# Altium schematic sheet QPL9065.SchDoc: Title
size 420 x 297 mm; CheckedBy: -; CompanyName: CERN; DrawnBy: DrawnBy; Organization: CERN; Address1: European Organization for Nuclear Research; Address2: CH-1211 Genčve 23 - Switzerland; DocumentNumber: 4; Revision: -; SheetNumber: 4; SheetTotal: 10; EDA_Number: EDA-XXXXX-VX-X; Projet: -; ModifiedBy: -; CreateDate: XX/XX/XXXX; CheckedDate: -; Title2: Title2; DivGrp: TE/MPE; Designer: Designer; ModifiedDate: -
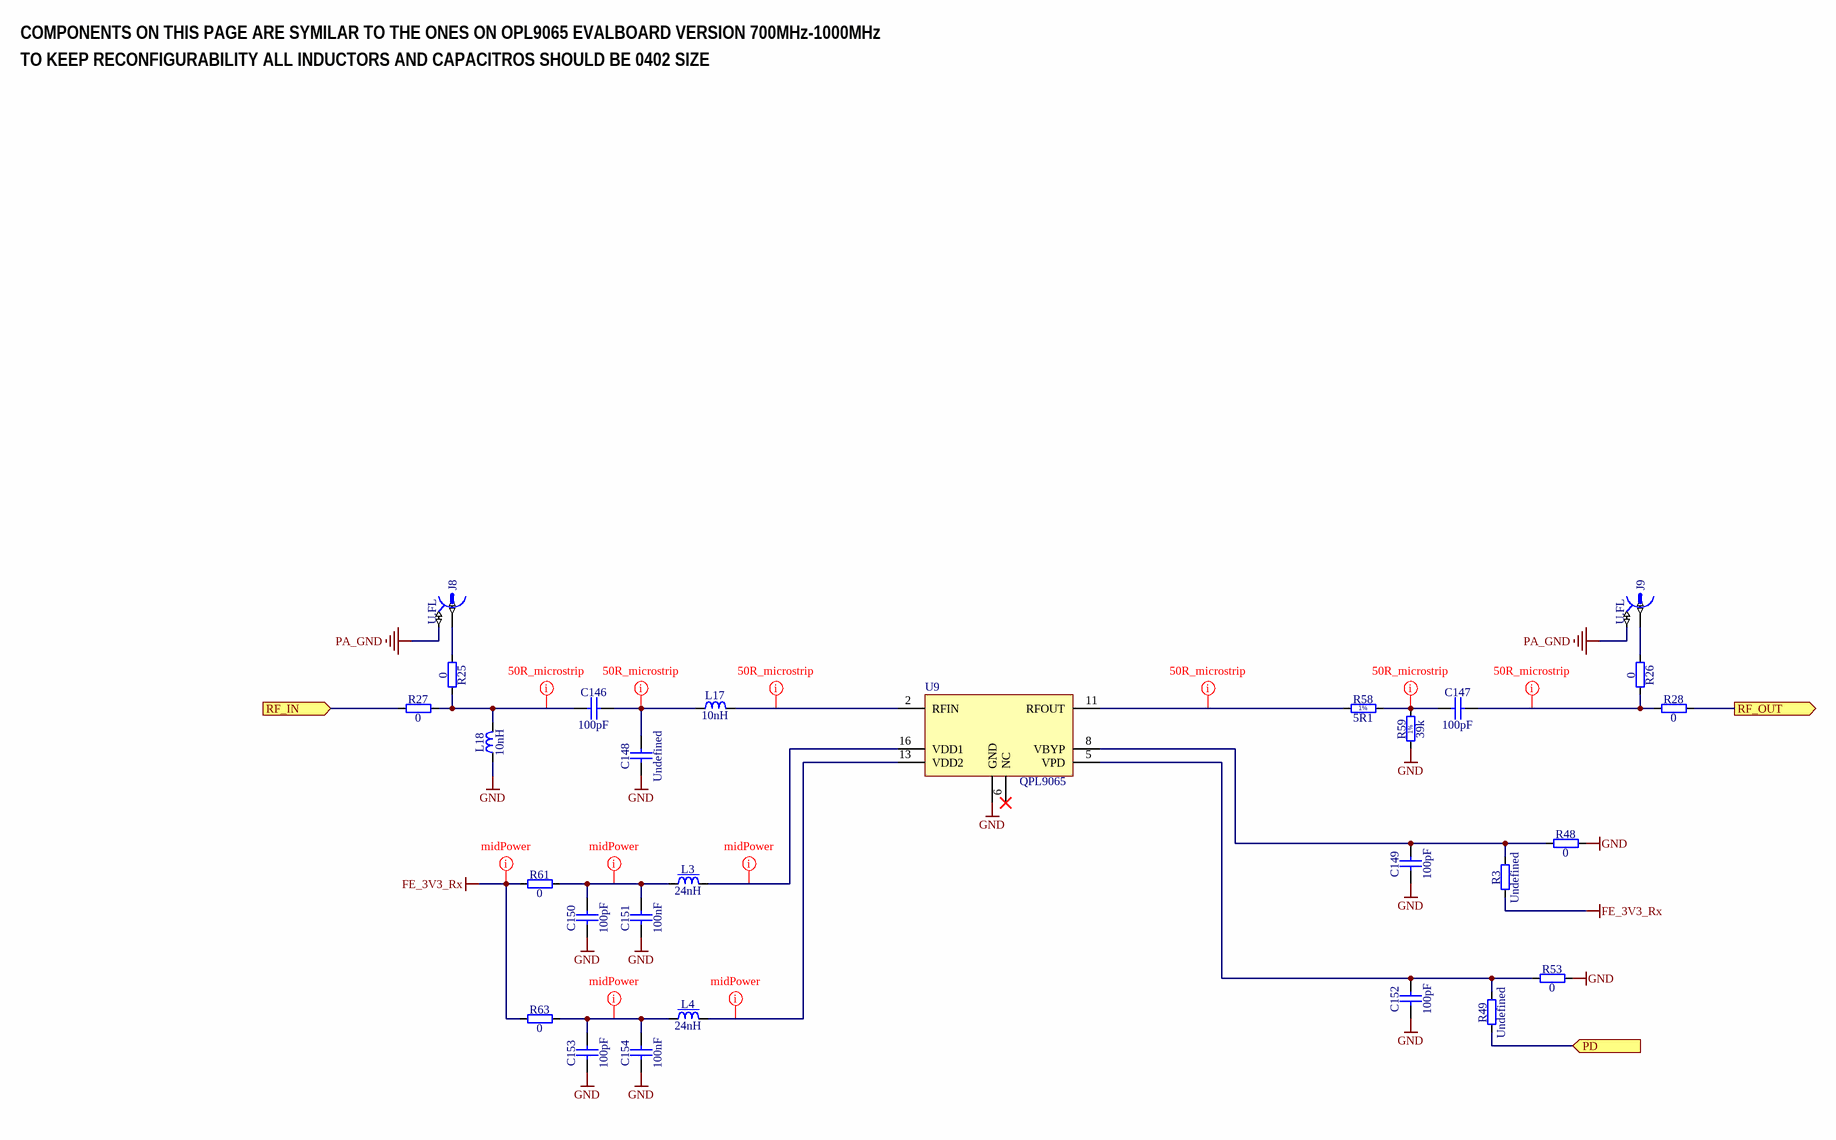
[diagram p0: QPL9065.SchDoc]

## Parts
C146  100pF  [CAPC1005X55N]
C147  100pF  [CAPC1005X55N]
C148  Undefined  [CAPC1005X55N]
C149  100pF  [CAPC1005X55N]
C150  100pF  [CAPC1005X55N]
C151  100nF  [CAPC1005X55N]
C152  100pF  [CAPC1005X55N]
C153  100pF  [CAPC1005X55N]
C154  100nF  [CAPC1005X55N]
J8  U.FL  [HIROSE_U.FL-R-SMT-1(10)]
J9  U.FL  [HIROSE_U.FL-R-SMT-1(10)]
L3  24nH  [IND_COILCRAFT_0805CS]
L4  24nH  [IND_COILCRAFT_0805CS]
L17  10nH  [INDC1005X55N]
L18  10nH  [INDC1005X55N]
R3  Undefined  [RESC1005X40N]
R25  0  [RESC1005X40N]
R26  0  [RESC1005X40N]
R27  0  [RESC1005X40N]
R28  0  [RESC1005X40N]
R48  0  [RESC1005X40N]
R49  Undefined  [RESC1005X40N]
R53  0  [RESC1005X40N]
R58  5R1  [RESC1005X40N]
R59  39k  [RESC1005X40N]
R61  0  [RESC1608X55N]
R63  0  [RESC1608X55N]
U9  QPL9065  [QPL9065]

## Ports
PD (in), RF_IN (in), RF_OUT (out)

## Nets
FE_3V3_Rx: R3.1 R61.1 R63.1
GND: C148.1 C149.1 C150.1 C151.1 C152.1 C153.1 C154.1 L18.1 R48.2 R53.2 R59.1 U9.1,3,4,7,9,10,12,14,15(GND)
PA_GND: J8.2 J9.2
PD: R49.1 ; port PD
RF_IN: R27.1 ; port RF_IN
RF_OUT: R28.2 ; port RF_OUT
NetC146_1: C146.1 L18.2 R25.2 R27.2
NetC146_2: C146.2 C148.2 L17.1
NetC147_1: C147.1 R58.2 R59.2
NetC147_2: C147.2 R26.2 R28.1
NetC149_2: C149.2 R3.2 R48.1 U9.8(VBYP)
NetC150_2: C150.2 C151.2 L3.1 R61.2
NetC152_2: C152.2 R49.2 R53.1 U9.5(VPD)
NetC153_2: C153.2 C154.2 L4.1 R63.2
NetJ8_1: J8.1 R25.1
NetJ9_1: J9.1 R26.1
NetL3_2: L3.2 U9.16(VDD1)
NetL4_2: L4.2 U9.13(VDD2)
NetL17_2: L17.2 U9.2(RFIN)
NetR58_1: R58.1 U9.11(RFOUT)

Not connected (* = marked no-connect by the designer): U9 6(NC)*

## Layout directives
net class midPower: FE_3V3_Rx, NetC150_2, NetC153_2, NetL3_2, NetL4_2
net class 50R_class: NetC146_1, NetC146_2, NetC147_1, NetC147_2, NetL17_2, NetR58_1

## Notes on the sheet
- COMPONENTS ON THIS PAGE ARE SYMILAR TO THE ONES ON OPL9065 EVALBOARD VERSION 700MHz-1000MHz
- TO KEEP RECONFIGURABILITY ALL INDUCTORS AND CAPACITROS SHOULD BE 0402 SIZE
- Project/Equipment
- Document
- Designer
- Drawn by
- Check.by
- File
- Last Mod.
- Print Date
- Sheet
- Size
- A3
- of
- Rev
- (in symbol R0402_5R1_1%_0.0625W_100PPM) 1%
- (in symbol R0402_39K_1%_0.0625W_100PPM) 1%

## Library data of the parts
C146 C147 C149 C150 C152 C153 = CC0402_100PF_50V_5%_C0G: Non-polarised capacitor; Part Description: SMD Multilayer Chip Ceramic Capacitor; Manufacturer: GENERIC; Manufacturer1 Part Number: C0402C101J5GACTU; Voltage: 50V; TC: C0G/NP0; Tolerance: ±5%; Part Number: CC0402_100PF_50V_5%_C0G; Component Kind: Standard; Component Type: Standard; Pin Count: 2; Value: 100pF; Status: Preferred; Manufacturer Part Number: CC0402_100PF_50V_5%_C0G; Case: 0402; Mounted: Yes; Socket: No; SMD: Yes; Sense: No; Manufacturer1 Example: KEMET; Manufacturer1 ComponentHeight: 0.55mm; HelpURL: \\cern.ch\dfs\Applications\Altium\Datasheets\CC0805_C0G_KEMET_(Commercial Grade).pdf; Author: CERN DEM JLC; CreateDate: 03.12.2007; LatestRevisionDate: 22.04.2015
C148 = CC0402_NO-VALUE: Non-polarised capacitor; Part Description: Reserved Footprint For 0402(1005) Chip Ceramic Capacitor; Mounted: No; Part Number: CC0402_NO-VALUE; Component Kind: Standard; Component Type: Standard; Pin Count: 2; Value: Undefined; Status: None; Manufacturer: Undefined; Manufacturer Part Number: CC0402_NO-VALUE; Case: 0402; Socket: No; SMD: Yes; Sense: No; Manufacturer1 ComponentHeight: 0.55mm; HelpURL: Undefined; Author: CERN DEM JLC; CreateDate: 14.01.2014; LatestRevisionDate: 14.01.2014
C151 C154 = CC0402_100NF_50V_10%_X7R: Non-polarised capacitor; Part Description: SMD Multilayer Chip Ceramic Capacitor; Manufacturer: GENERIC; Manufacturer1 Part Number: GRM155R71H104KE14D; Voltage: 50V; TC: X7R; Tolerance: ±10%; Part Number: CC0402_100NF_50V_10%_X7R; Component Kind: Standard; Component Type: Standard; Pin Count: 2; Value: 100nF; Status: None; Manufacturer Part Number: CC0402_100NF_50V_10%_X7R; Case: 0402; Mounted: Yes; Socket: No; SMD: Yes; Sense: No; Manufacturer1 Example: MURATA; Manufacturer1 ComponentHeight: 0.55mm; HelpURL: \\cern.ch\dfs\Applications\Altium\Datasheets\CC0402_MURATA_GRM155R71H104KE14D.pdf; Author: CERN DEM MR; CreateDate: 30.06.2017; LatestRevisionDate: 30.06.2017
J8 J9 = HIROSE_U.FL-R-SMT-1(10): Part Description: Up to 6GHz Ultra Small Surface Mount Male Coaxial Connectors U.FL Series; Manufacturer: HIROSE (HRS); PressFit: No; Part Number: HIROSE_U.FL-R-SMT-1(10); Component Kind: Standard; Component Type: Standard; Pin Count: 2; Family: U.FL; Mounted: Yes; Socket: No; SMD: Yes; Sense: No; Status: None; Manufacturer Part Number: U.FL-R-SMT-1(10); ComponentHeight: 1.25mm; HelpURL: \\cern.ch\dfs\Applications\Altium\Datasheets\HIROSE_U.FL-R-SMT-1(10).pdf; Author: CERN DEM JLC; CreateDate: 24.03.2010; LatestRevisionDate: 24.03.2010
L3 L4 = IND_24NH_2%_COILCRAFT_0805CS: Inductor With Core; Part Description: SMT Chip Inductor; Manufacturer Part Number: 0805CS-240XGLB; Power: 500mA; Resistance: 0.22R; Tolerance: ±2%; Part Number: IND_24NH_2%_COILCRAFT_0805CS; Component Kind: Standard; Component Type: Standard; Pin Count: 2; Value: 24nH; Status: None; Manufacturer: COILCRAFT; Case: 0805; Mounted: Yes; Socket: No; SMD: Yes; Sense: No; ComponentHeight: 1.52mm; HelpURL: \\cern.ch\dfs\Applications\Altium\Datasheets\IND_COILCRAFT_0805CS.pdf; Author: CERN DEM JLC; CreateDate: 19.08.2013; LatestRevisionDate: 19.08.2013
L17 L18 = Inductor_0402_10nH: Inductor; Part Number: IND_10NH; Tolerance: ±1%; Component Kind: Standard; Component Type: Standard; Pin Count: 2; Value: 10nH; Status: None; Mounted: Yes; Socket: No; SMD: Yes; Sense: No
R3 R49 = R0402_NO-VALUE: Resistor; Part Description: Reserved Footprint For a 0402 (1005) Chip Resistor; PressFit: No; Mounted: No; Part Number: R0402_NO-VALUE; Component Kind: Standard; Component Type: Standard; Pin Count: 2; Value: Undefined; Status: None; Manufacturer: Undefined; Manufacturer Part Number: R0402_NO-VALUE; Case: 0402; Sense: No; Socket: No; SMD: Yes; Manufacturer1 Example: Undefined; Manufacturer1 Part Number: Undefined; Manufacturer1 ComponentHeight: Undefined; HelpURL: Undefined; Author: CERN DEM JLC; CreateDate: 03.12.2007; LatestRevisionDate: 13.03.2008
R25-R28 R48 R53 = R0402_0R_JUMPER: Resistor; Part Description: 1A (0.05R Max DC Resistance) Zero Ohm Jumper; Manufacturer: GENERIC; Manufacturer1 Part Number: 232270591001L; PressFit: No; Part Number: R0402_0R_JUMPER; Component Kind: Standard; Component Type: Standard; Pin Count: 2; Value: 0; Status: Not Recommended; Manufacturer Part Number: R0402_0R_JUMPER; Case: 0402; Mounted: Yes; Sense: No; Socket: No; SMD: Yes; Manufacturer1 Example: YAGEO PHYCOMP; Manufacturer1 ComponentHeight: 0.4mm; HelpURL: \\cern.ch\dfs\Applications\Altium\Datasheets\R0402_Phycomp_RC0402.pdf; Author: CERN DEM JLC; CreateDate: 03.12.2007; LatestRevisionDate: 17.10.2012
R58 = R0402_5R1_1%_0.0625W_100PPM: Resistor - 1%; Part Description: General Purpose Thick Film Chip Resistor; Manufacturer: GENERIC; Manufacturer1 Part Number: CRCW04025R10FKED; TC: ±100ppm/°C; PressFit: No; Part Number: R0402_5R1_1%_0.0625W_100PPM; Component Kind: Standard; Component Type: Standard; Pin Count: 2; Value: 5R1; Status: Not Recommended; Power: 0.0625W; Tolerance: ±1%; Manufacturer Part Number: R0402_5R1_1%_0.0625W_100PPM; Case: 0402; Mounted: Yes; Sense: No; Socket: No; SMD: Yes; Manufacturer1 Example: VISHAY; Manufacturer1 ComponentHeight: 0.4mm; HelpURL: \\cern.ch\dfs\Applications\Altium\Datasheets\R0402_VISHAY_CRCW e3.pdf; Author: CERN DEM MR; CreateDate: 22.11.2016; LatestRevisionDate: 22.11.2016
R59 = R0402_39K_1%_0.0625W_100PPM: Resistor - 1%; Part Description: General Purpose Thick Film Chip Resistor; Manufacturer: GENERIC; Manufacturer1 Part Number: 232270673903; TC: ±100ppm/°C; PressFit: No; Part Number: R0402_39K_1%_0.0625W_100PPM; Component Kind: Standard; Component Type: Standard; Pin Count: 2; Value: 39k; Status: Not Recommended; Power: 0.0625W; Tolerance: ±1%; Manufacturer Part Number: R0402_39K_1%_0.0625W_100PPM; Case: 0402; Mounted: Yes; Sense: No; Socket: No; SMD: Yes; Manufacturer1 Example: YAGEO PHYCOMP; Manufacturer1 ComponentHeight: 0.4mm; HelpURL: \\cern.ch\dfs\Applications\Altium\Datasheets\R0402_Phycomp_RC0402.pdf; Author: CERN DEM JLC; CreateDate: 03.12.2007; LatestRevisionDate: 17.10.2012
R61 R63 = R0603_0R_JUMPER: Resistor; Part Description: 1A (0.05R Max DC Resistance) Zero Ohm Jumper; Manufacturer: GENERIC; Manufacturer1 Part Number: NRC06Z0; PressFit: No; Part Number: R0603_0R_JUMPER; Component Kind: Standard; Component Type: Standard; Pin Count: 2; Value: 0; Status: Preferred; Manufacturer Part Number: R0603_0R_JUMPER; Case: 0603; Mounted: Yes; Sense: No; Socket: No; SMD: Yes; Manufacturer1 Example: NIC COMPONENT; Manufacturer1 ComponentHeight: 0.55mm; HelpURL: \\cern.ch\dfs\Applications\Altium\Datasheets\R0603_NIC_NRC.pdf; Author: CERN DEM JLC; CreateDate: 03.12.2007; LatestRevisionDate: 13.03.2008